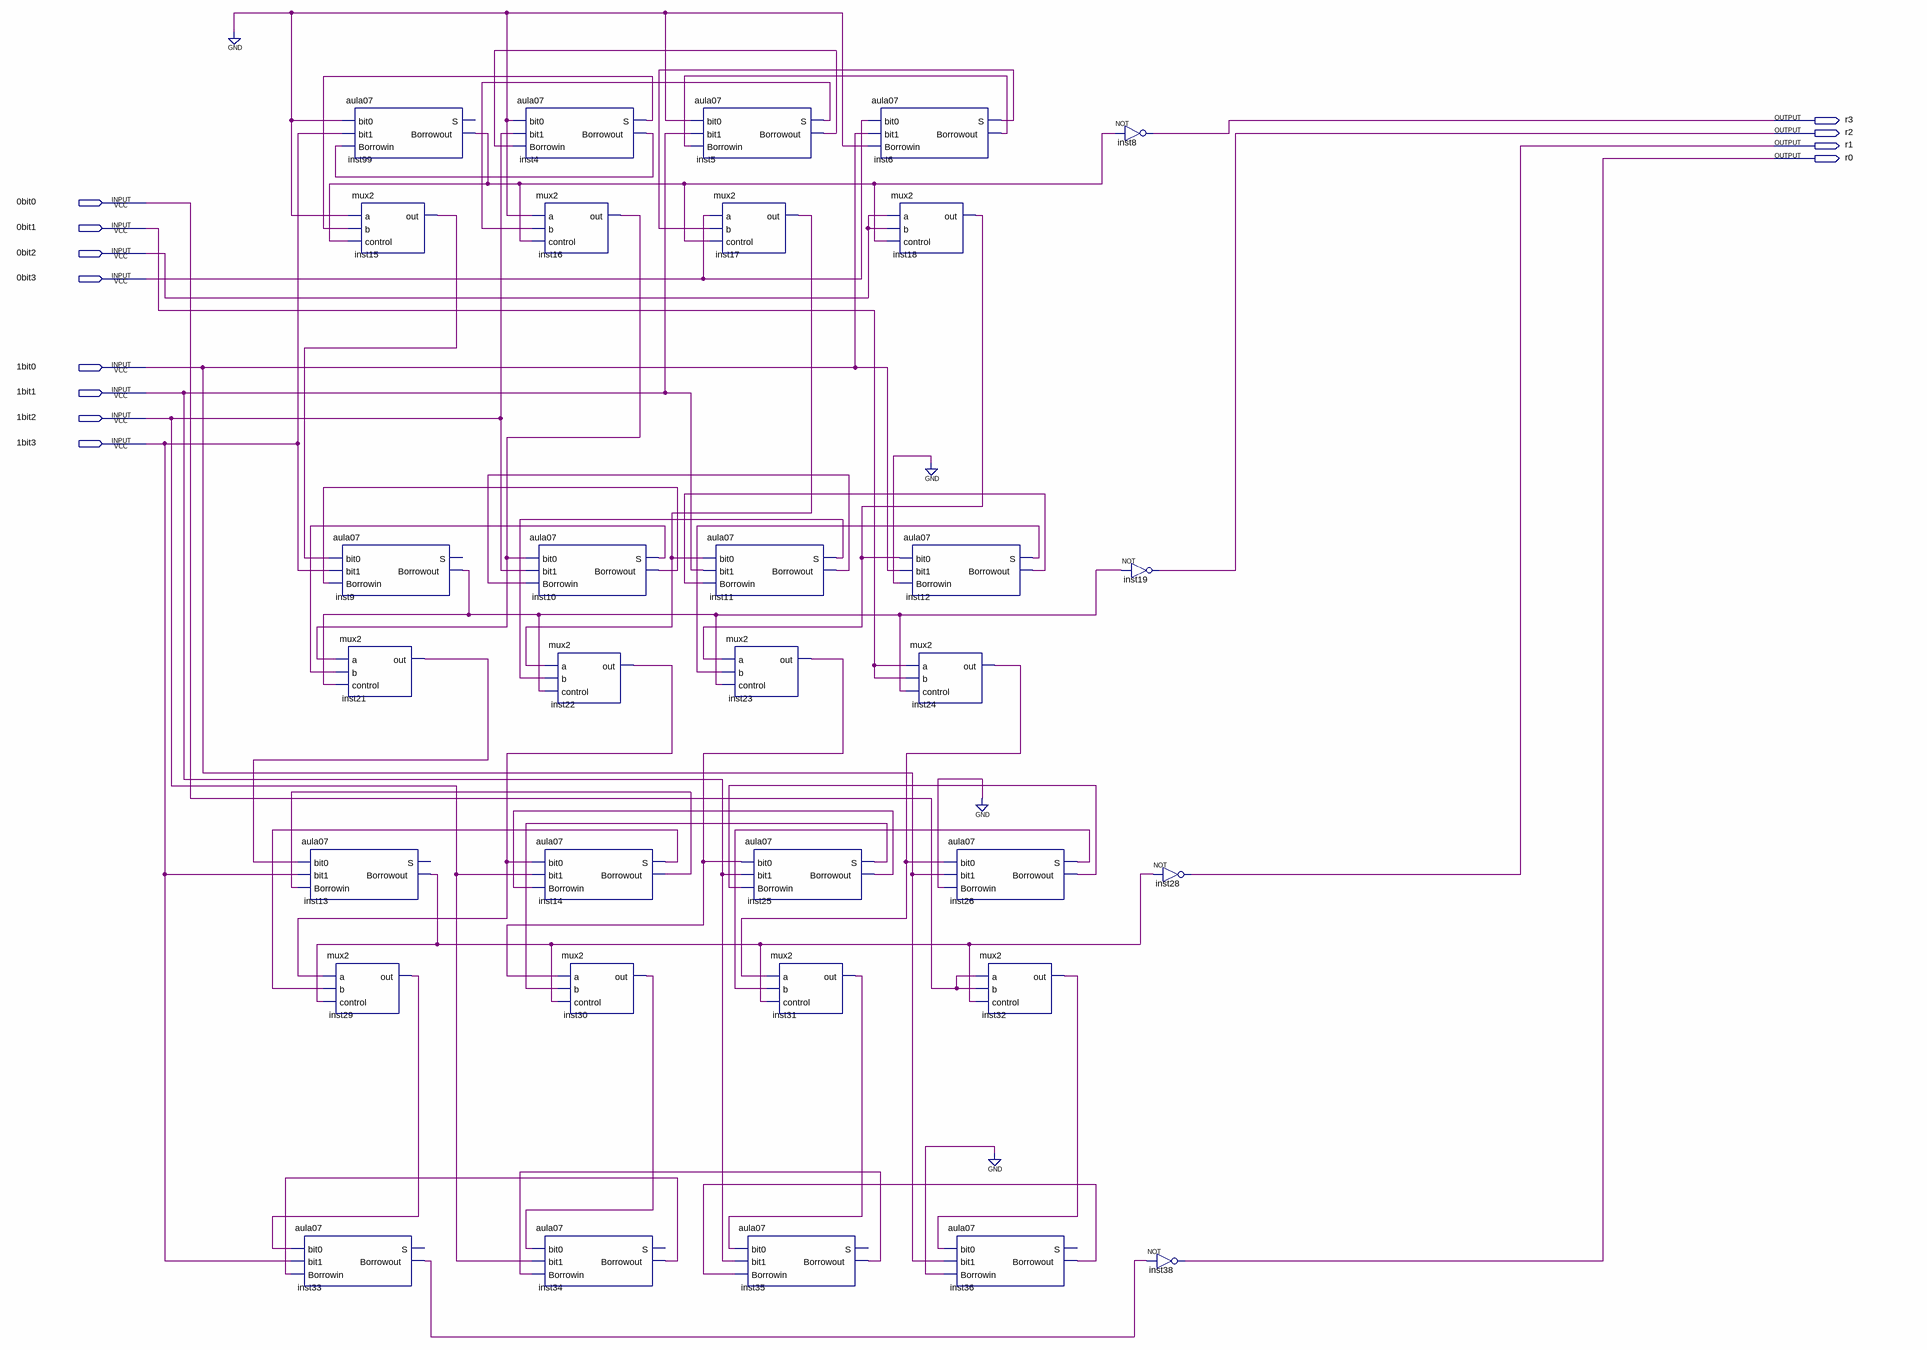
[diagram p0: schematic sheet]
// Quartus schematic aula11.bdf as structural Verilog: 32 symbols, 12 pins
module aula11 (
  input  \0bit0 ,
  input  \0bit1 ,
  input  \0bit2 ,
  input  \0bit3 ,
  input  \1bit0 ,
  input  \1bit1 ,
  input  \1bit2 ,
  input  \1bit3 ,
  output r3,
  output r2,
  output r1,
  output r0
);

  wire inst4_borrowout, inst4_s, inst5_borrowout, inst5_s, inst6_borrowout, inst6_s, inst9_borrowout,
       inst10_borrowout, inst10_s, inst11_borrowout, inst11_s, inst12_borrowout, inst12_s, inst13_borrowout,
       inst14_borrowout, inst14_s, inst15_out, inst16_out, inst17_out, inst18_out, inst21_out, inst22_out,
       inst23_out, inst24_out, inst25_borrowout, inst25_s, inst26_borrowout, inst26_s, inst29_out,
       inst30_out, inst31_out, inst32_out, inst33_borrowout, inst34_borrowout, inst35_borrowout,
       inst36_borrowout, inst99_borrowout;

  aula07 inst13 (
    .bit0(inst21_out), .bit1(\1bit3 ), .Borrowin(inst14_borrowout), .Borrowout(inst13_borrowout));  // open: S
  mux2 inst29 (.a(inst22_out), .b(inst14_s), .control(inst13_borrowout), .out(inst29_out));
  aula07 inst33 (
    .bit0(inst29_out), .bit1(\1bit3 ), .Borrowin(inst34_borrowout), .Borrowout(inst33_borrowout));  // open: S
  aula07 inst99 (.bit0(1'b0), .bit1(\1bit3 ), .Borrowin(inst4_borrowout), .Borrowout(inst99_borrowout));  // open: S
  mux2 inst15 (.a(1'b0), .b(inst4_s), .control(inst99_borrowout), .out(inst15_out));
  aula07 inst9 (
    .bit0(inst15_out), .bit1(\1bit3 ), .Borrowin(inst10_borrowout), .Borrowout(inst9_borrowout));  // open: S
  mux2 inst21 (.a(inst16_out), .b(inst10_s), .control(inst9_borrowout), .out(inst21_out));
  aula07 inst4 (.bit0(1'b0), .bit1(\1bit2 ), .Borrowin(inst5_borrowout), .S(inst4_s), .Borrowout(inst4_borrowout));
  aula07 inst10 (
    .bit0(inst16_out), .bit1(\1bit2 ), .Borrowin(inst11_borrowout), .S(inst10_s), .Borrowout(inst10_borrowout));
  mux2 inst16 (.a(1'b0), .b(inst5_s), .control(inst99_borrowout), .out(inst16_out));
  mux2 inst22 (.a(inst17_out), .b(inst11_s), .control(inst9_borrowout), .out(inst22_out));
  aula07 inst14 (
    .bit0(inst22_out), .bit1(\1bit2 ), .Borrowin(inst25_borrowout), .S(inst14_s), .Borrowout(inst14_borrowout));
  mux2 inst30 (.a(inst23_out), .b(inst25_s), .control(inst13_borrowout), .out(inst30_out));
  aula07 inst34 (
    .bit0(inst30_out), .bit1(\1bit2 ), .Borrowin(inst35_borrowout), .Borrowout(inst34_borrowout));  // open: S
  aula07 inst5 (.bit0(1'b0), .bit1(\1bit1 ), .Borrowin(inst6_borrowout), .S(inst5_s), .Borrowout(inst5_borrowout));
  mux2 inst17 (.a(\0bit3 ), .b(inst6_s), .control(inst99_borrowout), .out(inst17_out));
  aula07 inst11 (
    .bit0(inst17_out), .bit1(\1bit1 ), .Borrowin(inst12_borrowout), .S(inst11_s), .Borrowout(inst11_borrowout));
  mux2 inst23 (.a(inst18_out), .b(inst12_s), .control(inst9_borrowout), .out(inst23_out));
  aula07 inst25 (
    .bit0(inst23_out), .bit1(\1bit1 ), .Borrowin(inst26_borrowout), .S(inst25_s), .Borrowout(inst25_borrowout));
  mux2 inst31 (.a(inst24_out), .b(inst26_s), .control(inst13_borrowout), .out(inst31_out));
  aula07 inst35 (
    .bit0(inst31_out), .bit1(\1bit1 ), .Borrowin(inst36_borrowout), .Borrowout(inst35_borrowout));  // open: S
  aula07 inst6 (.bit0(\0bit3 ), .bit1(\1bit0 ), .Borrowin(1'b0), .S(inst6_s), .Borrowout(inst6_borrowout));
  mux2 inst18 (.a(\0bit2 ), .b(\0bit2 ), .control(inst99_borrowout), .out(inst18_out));
  aula07 inst12 (.bit0(inst18_out), .bit1(\1bit0 ), .Borrowin(1'b0), .S(inst12_s), .Borrowout(inst12_borrowout));
  mux2 inst24 (.a(\0bit1 ), .b(\0bit1 ), .control(inst9_borrowout), .out(inst24_out));
  aula07 inst26 (.bit0(inst24_out), .bit1(\1bit0 ), .Borrowin(1'b0), .S(inst26_s), .Borrowout(inst26_borrowout));
  mux2 inst32 (.a(\0bit0 ), .b(\0bit0 ), .control(inst13_borrowout), .out(inst32_out));
  aula07 inst36 (.bit0(inst32_out), .bit1(\1bit0 ), .Borrowin(1'b0), .Borrowout(inst36_borrowout));  // open: S
  not inst8 (r3, inst99_borrowout);
  not inst19 (r2, inst9_borrowout);
  not inst28 (r1, inst13_borrowout);
  not inst38 (r0, inst33_borrowout);
endmodule
